# EAGLE schematic DualGainAmp (EAGLE 9.6.2)
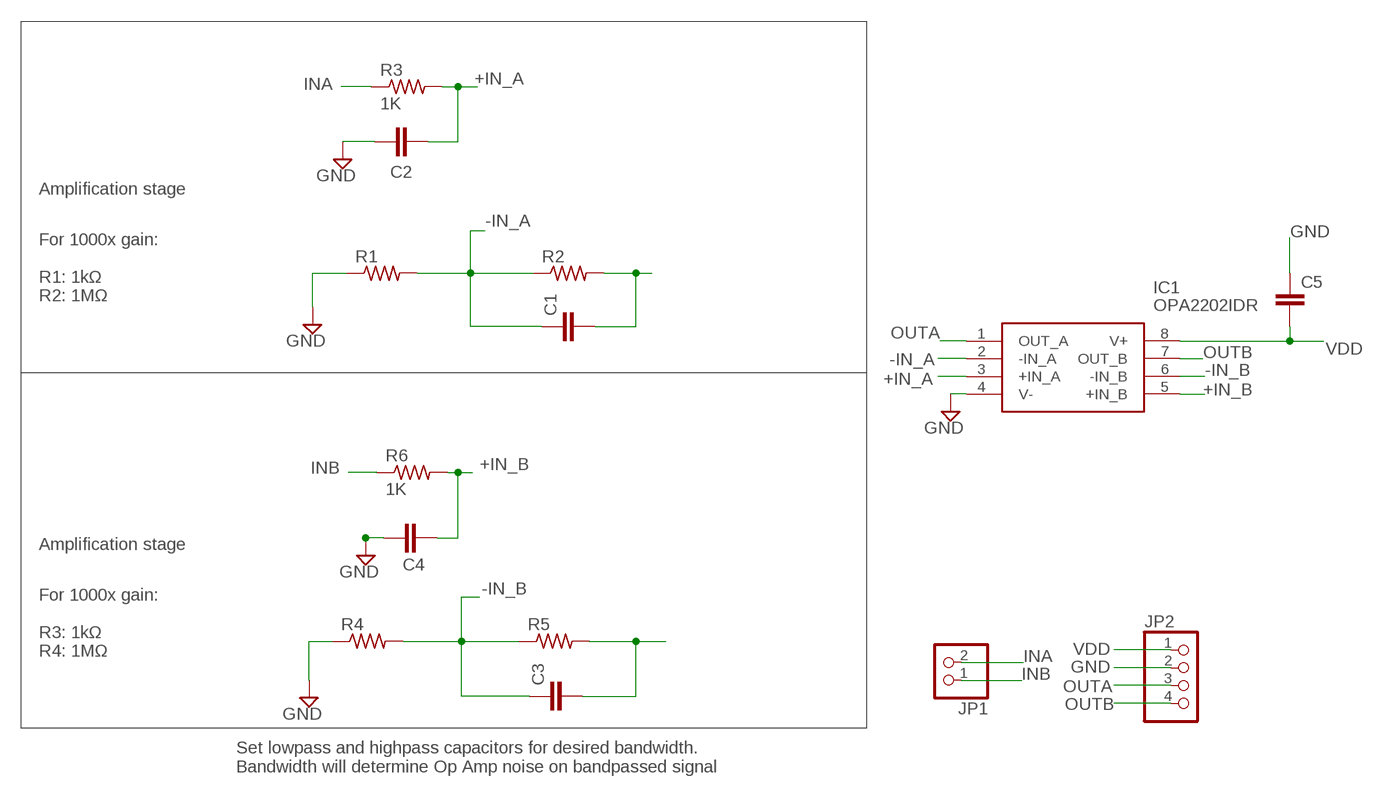
[diagram p0: schematic, sheet 1]

## Parts
C1  C-EUC0402  [C0402]
C2  C-EUC0402  [C0402]
C3  C-EUC0402  [C0402]
C4  C-EUC0402  [C0402]
C5  C2.5/2  [C2.5-2]
IC1  OPA2202IDR  [SOIC127P600X175-8N]
JP1  PINHD-1X2  [1X02]
JP2  PINHD-1X4  [1X04]
R1  R-US_0204/5  [0204/5]
R2  R-US_0204/5  [0204/5]
R3  1K  R-US_0204/5  [0204/5]
R4  R-US_0204/5  [0204/5]
R5  R-US_0204/5  [0204/5]
R6  1K  R-US_0204/5  [0204/5]

## Nets
+IN_A: C2.2 IC1.3(+IN_A) R3.2
+IN_B: C4.2 IC1.5(+IN_B) R6.2
-IN_A: C1.1 IC1.2(-IN_A) R1.2 R2.1
-IN_B: C3.1 IC1.6(-IN_B) R4.2 R5.1
GND: C2.1 C4.1 C5.1 IC1.4(V-) JP2.2 R1.1 R4.1
INA: JP1.2 R3.1
INB: JP1.1 R6.1
N$3: C1.2 R2.2
N$4: C3.2 R5.2
OUTA: IC1.1(OUT_A) JP2.3
OUTB: IC1.7(OUT_B) JP2.4
VDD: C5.2 IC1.8(V+) JP2.1

## Notes on the sheet
- Amplification stage
- For 1000x gain:
  
  R1: 1kΩ
  R2: 1MΩ
- Amplification stage
- For 1000x gain:
  
  R3: 1kΩ
  R4: 1MΩ
- Set lowpass and highpass capacitors for desired bandwidth.
  Bandwidth will determine Op Amp noise on bandpassed signal

## Library data of the parts
C1-C4 = rcl:C-EU: CAPACITOR, European symbol; SPICEPREFIX: C
C5 = capacitor-wima:C: CAPACITOR naming: grid - package width
IC1 = OPA2202IDR:OPA2202IDR: Operational Amplifiers - Op Amps Low noise (0.2- uVPP, 9-nV/ Hz), heavy capacitive drive (25-nF), super beta, precision op amp, dual 8-SOIC -40 to 150 Source: Datasheet <https://www.ti.com/lit/ds/symlink/opa2202.pdf>; DESCRIPTION: Operational Amplifiers - Op Amps Low noise (0.2- uVPP, 9-nV/ Hz), heavy capacitive drive (25-nF), super beta, precision op amp, dual 8-SOIC -40 to 150; HEIGHT: 1.75mm; MANUFACTURER_NAME: Texas Instruments; MANUFACTURER_PART_NUMBER: OPA2202IDR; MOUSER_PART_NUMBER: 595-OPA2202IDR; MOUSER_PRICE-STOCK: https://www.mouser.co.uk/ProductDetail/Texas-Instruments/OPA2202IDR?qs=T94vaHKWudT4AJaF64Y1cw%3D%3D
JP1 = pinhead:PINHD-1X2: PIN HEADER
JP2 = pinhead:PINHD-1X4: PIN HEADER
R1-R6 = rcl:R-US_: RESISTOR, American symbol; SPICEPREFIX: R